# EAGLE design arduino cw nano keyer (EAGLE 7.6.0)
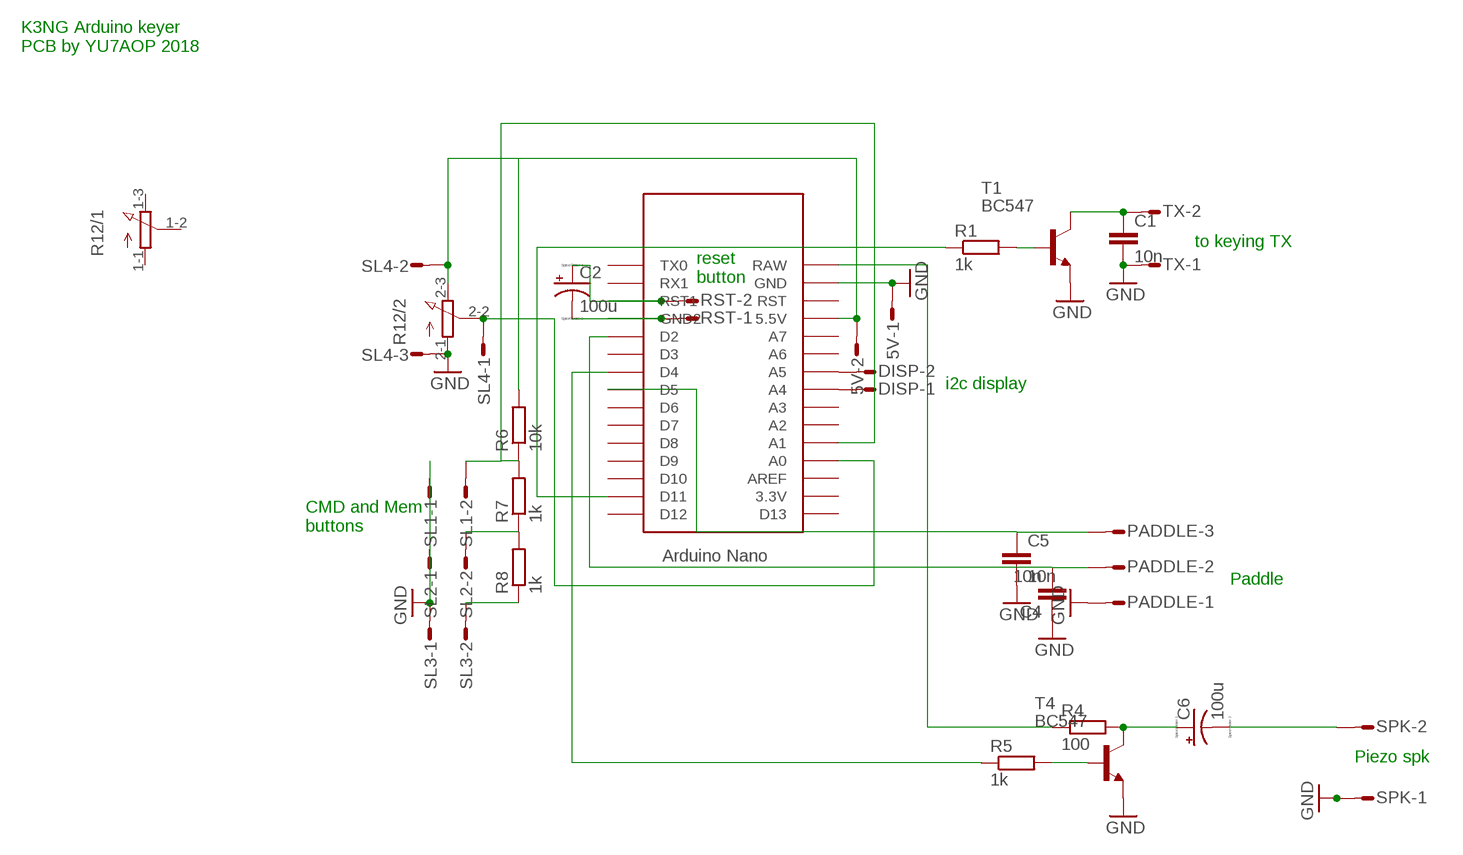
[diagram p0: schematic, sheet 1]

## Parts
5V  M02S  [02P]
C1  10n  C-EU050-025X075  [C050-025X075]
C2  100u  CPOL-USE2.5-5  [E2,5-5]
C4  10n  C-EU050-025X075  [C050-025X075]
C5  10n  C-EU050-025X075  [C050-025X075]
C6  100u  CPOL-USE2.5-5  [E2,5-5]
DISP  M02S  [02P]
PADDLE  M03S  [03P]
R1  1k  R-EU_0207/10  [0207/10]
R4  100  R-EU_0207/10  [0207/10]
R5  1k  R-EU_0207/10  [0207/10]
R6  10k  R-EU_0207/10  [0207/10]
R7  1k  R-EU_0207/10  [0207/10]
R8  1k  R-EU_0207/10  [0207/10]
R12  3RP/1610G  [3RP/1610G]
RST  M02S  [02P]
SL1  M02S  [02P]
SL2  M02S  [02P]
SL3  M02S  [02P]
SL4  M03S  [03P]
SPK  M02S  [02P]
T1  BC547  [TO92]
T4  BC547  [TO92]
TX  M02S  [02P]
U$1  NANO  [NANO]

## Nets
GND: 5V.1 C1.2 C4.1 C5.2 PADDLE.1 R12.2-1(/2:A) SL1.1 SL2.1 SL3.1 SL4.3 SPK.1 T1.1(E) T4.1(E) TX.1 U$1.GND
N$1: R6.1 R7.2 SL1.2 U$1.A1
N$2: R7.1 R8.2 SL2.2
N$3: R8.1 SL3.2
N$4: C2.- RST.1 U$1.GND1(GND2)
N$5: C2.+ RST.2 U$1.RST1
N$6: R1.2 T1.2(B)
N$7: C1.1 T1.3(C) TX.2
N$8: DISP.2 U$1.A5
N$9: DISP.1 U$1.A4
N$11: R1.1 U$1.D11
N$12: R5.2 T4.2(B)
N$13: C6.+ R4.2 T4.3(C)
N$14: 5V.2 R6.2 R12.2-3(/2:E) SL4.2 U$1.5V(5.5V)
N$16: R5.1 U$1.D4
N$17: R12.2-2(/2:S) SL4.1 U$1.A0
N$18: C5.1 PADDLE.3 U$1.D5
N$19: C4.2 PADDLE.2 U$1.D2
N$20: C6.- SPK.2
N$21: R4.1 U$1.RAW
Unconnected: R12.1-1(/1:A) R12.1-2(/1:S) R12.1-3(/1:E) U$1.3.3V U$1.A2 U$1.A3 U$1.A6 U$1.A7 U$1.AREF U$1.D3 U$1.D6 U$1.D7 U$1.D8 U$1.D9 U$1.D10 U$1.D12 U$1.D13 U$1.ICSP1 U$1.ICSP2 U$1.ICSP3 U$1.ICSP4 U$1.ICSP5 U$1.ICSP6 U$1.RST U$1.RX1 U$1.TX0

## Notes on the sheet
- K3NG Arduino keyer
  PCB by YU7AOP 2018
- to keying TX
- reset
  button
- i2c display
- CMD and Mem
  buttons
- Paddle
- Piezo spk

## Library data of the parts
5V DISP RST SL1-SL3 SPK TX = con-amp-quick:M02S: AMP QUICK CONNECTOR; OC_FARNELL: unknown; OC_NEWARK: unknown
C1 C4 C5 = resistor:C-EU: CAPACITOR, European symbol
C2 C6 = resistor:CPOL-US: POLARIZED CAPACITOR, American symbol
PADDLE SL4 = con-amp-quick:M03S: AMP QUICK CONNECTOR; OC_FARNELL: unknown; OC_NEWARK: unknown
R1 R4-R8 = resistor:R-EU_: RESISTOR, European symbol
R12 = pot:3RP/1610G: 16mm Potentiometer two level Source: http://www.alphapotentiometers.net/html/16mm_pot_2.html
T1 T4 = transistor:BC547: NPN TRANSISTOR
U$1 = Arduino-clone:NANO: Arduino Nano

## Board
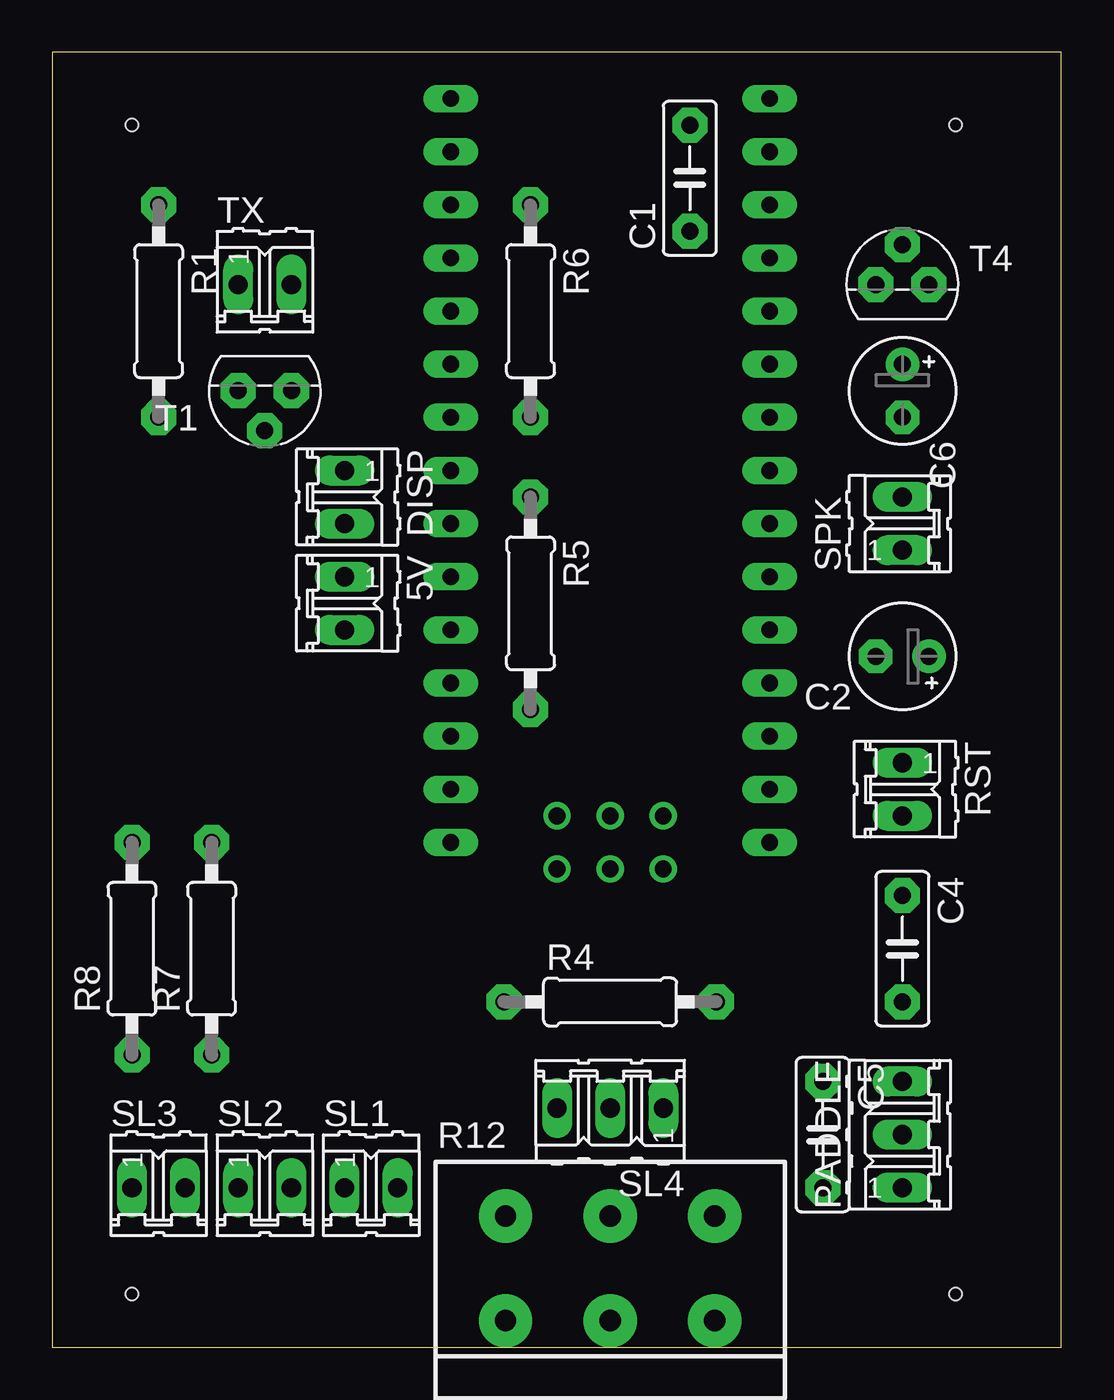
[diagram p1: board, top side]
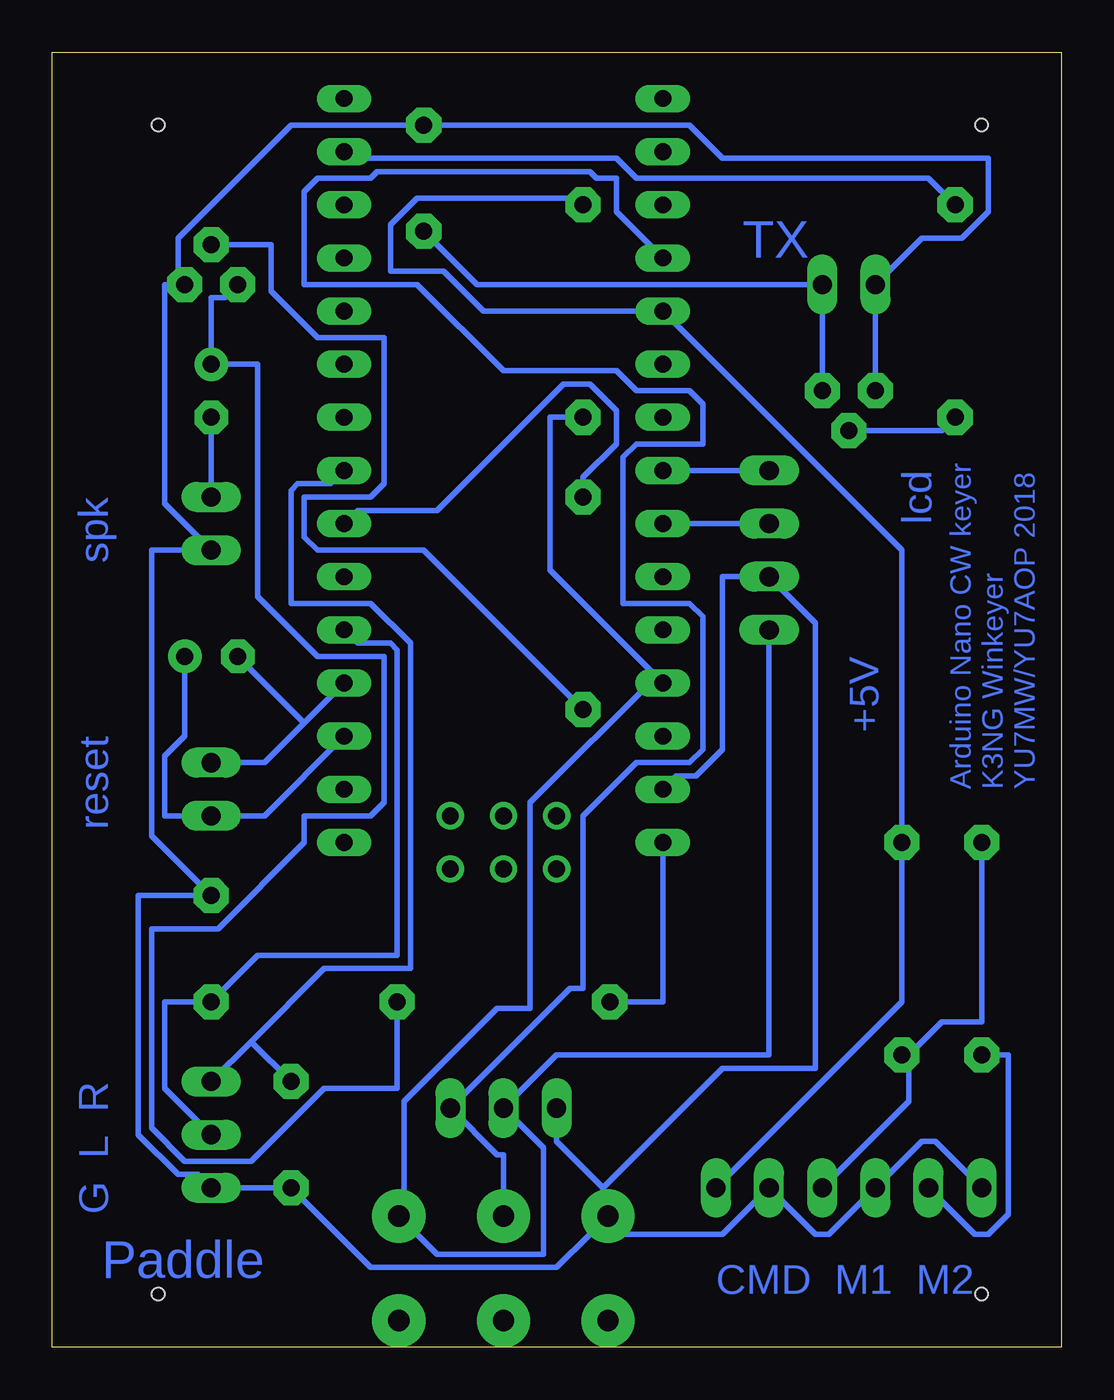
[diagram p2: board, bottom side, seen from below]

Size 48.24 x 61.9 mm. Coordinates in mm from the lower left corner, seen from the top.
Outline: 0,0 48.24,0 48.24,61.9 0,61.9 0,0
Copper layers (1*16): Top 0.035mm / dielectric 1.5mm / Bottom 0.035mm
Design rules "default *": minimum track width 10mil, minimum drill 24mil, track to track 15mil, track to pad 15mil, pad to pad 8mil, via to via 8mil, smd to smd 8mil, copper to edge 40mil, drill to drill 8mil, minimum pad ring 10mil, minimum via ring 8mil, stop-mask expansion 4mil, vias tented up to drill 0mil, thermal gap 10mil
Holes 0.6 mm at 3.81,58.42 43.18,58.42 3.81,2.54 43.18,2.54

### Footprints (pad centres in the part's own frame; a part is rotated, then mirrored left to right if it is on the bottom)
02P = drill 0.914 long: 1 -1.27,0; 2 1.27,0
C050-025X075 = drill 0.813 pad 1.676 octagon: 1 -2.54,0; 2 2.54,0
E2,5-5 = drill 0.813 pad 1.6: + -1.27,0 | drill 0.813 pad 1.6 octagon: - 1.27,0
03P = drill 0.914 long: 1 -2.54,0; 2 0,0; 3 2.54,0
0207/10 = drill 0.813 pad 1.676 octagon: 1 -5.08,0; 2 5.08,0
3RP/1610G = drill 1.016 pad 2.54: 1-1 -5,0; 1-2 0,0; 1-3 5,0; 2-1 -5,5; 2-2 0,5; 2-3 5,5
TO92 = drill 0.813 pad 1.676 octagon: 1 1.27,0; 2 0,1.905; 3 -1.27,0
NANO = drill 0.8 long: 3.3V -10.16,24.13; 5V -10.16,-1.27; A0 -10.16,19.05; A1 -10.16,16.51; A2 -10.16,13.97; A3 -10.16,11.43; A4 -10.16,8.89; A5 -10.16,6.35; A6 -10.16,3.81; A7 -10.16,1.27; AREF -10.16,21.59; D2 5.08,1.27; D3 5.08,3.81; D4 5.08,6.35; D5 5.08,8.89; D6 5.08,11.43; D7 5.08,13.97; D8 5.08,16.51; D9 5.08,19.05; D10 5.08,21.59; D11 5.08,24.13; D12 5.08,26.67; D13 -10.16,26.67; GND -10.16,-6.35; GND1 5.08,-1.27; RAW -10.16,-8.89; RST -10.16,-3.81; RST1 5.08,-3.81; RX1 5.08,-6.35; TX0 5.08,-8.89 | drill 0.8: ICSP1 -5.08,-10.16; ICSP2 -5.08,-7.62; ICSP3 -2.54,-10.16; ICSP4 -2.54,-7.62; ICSP5 0,-10.16; ICSP6 0,-7.62

### Placement (x,y rotation side)
5V  13.97,35.56 270 top
C1  30.48,55.88 90 top
C2  40.64,33.02 180 top
C4  40.64,19.05 270 top
C5  36.83,10.16 270 top
C6  40.64,45.72 270 top
DISP  13.97,40.64 270 top
PADDLE  40.64,10.16 90 top
R1  5.08,49.53 270 top
R4  26.67,16.51 0 top
R5  22.86,35.56 270 top
R6  22.86,49.53 270 top
R7  7.62,19.05 90 top
R8  3.81,19.05 90 top
R12  26.67,1.27 0 top
RST  40.64,26.67 270 top
SL1  15.24,7.62 0 top
SL2  10.16,7.62 0 top
SL3  5.08,7.62 0 top
SL4  26.67,11.43 180 top
SPK  40.64,39.37 90 top
T1  10.16,45.72 180 top
T4  40.64,50.8 0 top
TX  10.16,50.8 0 top
U$1  29.21,33.02 0 top

### Tracks (layer width: path | path; a pad name or v marks a point on that pad's centre or on a via)
GND
  Bottom 0.254: U$1.GND 18.41,27.3 17.46,27.3 16.19,28.57 16.19,36.83 5V.1 11.75,34.61 11.75,13.34 16.19,13.34 21.91,7.62 | SL3.1 6.03,9.84 6.67,9.84 SL2.1 11.11,5.4 11.75,5.4 SL1.1 16.19,5.4 22.54,5.4 | SL4.3 24.13,9.84 21.91,7.62 | 21.91,7.62 21.91,6.35 R12.2-1 | R12.2-1 22.54,5.4 | 22.54,5.4 24.13,3.81 33.02,3.81 C5.2 PADDLE.1 41.27,8.26 42.23,8.26 44.13,10.16 44.13,21.59 C4.1 43.5,24.45 43.5,38.1 SPK.1 42.86,40.32 42.86,50.8 42.23,50.8 | 21.91,6.03 R12.2-1 | T1.1 TX.1 6.67,53.02 4.76,53.02 3.49,54.29 3.49,56.83 16.19,56.83 17.78,58.42 C1.2 36.83,58.42 42.23,53.02 42.23,50.8 | 42.23,50.8 T4.1
N$1
  Bottom 0.254: SL1.2 7.62,16.51 R7.2 7.62,38.1 U$1.A1 27.62,49.53 29.53,51.44 32.07,51.44 32.07,53.66 30.8,54.93 23.18,54.93 R6.1
N$2
  Bottom 0.254: SL2.2 7.3,11.75 7.3,13.97 | R8.2 3.81,15.56 5.71,15.56 7.3,13.97 | 7.3,13.97 R7.1
N$3
  Bottom 0.254: SL3.2 4.13,5.4 3.49,5.4 2.54,6.35 2.54,13.97 R8.1
N$4
  Bottom 0.254: 36.2,29.84 38.1,27.94 RST.1 | 36.2,29.84 U$1.GND1 | 36.2,29.84 C2.-
N$5
  Bottom 0.254: U$1.RST1 38.1,25.4 RST.2 42.86,25.4 42.86,28.26 41.91,29.21 C2.+
N$6
  Bottom 0.254: R1.2 5.71,43.81 T1.2
N$7
  Bottom 0.254: T1.3 TX.2 27.94,50.8 C1.1
N$8
  Bottom 0.254: DISP.2 U$1.A5
N$9
  Bottom 0.254: DISP.1 U$1.A4
N$11
  Bottom 0.254: U$1.D11 33.97,56.83 21.27,56.83 20.32,55.88 6.35,55.88 R1.1
N$12
  Bottom 0.254: R5.2 30.48,38.1 35.56,38.1 36.2,38.73 36.2,40.64 33.02,40.64 32.38,41.27 32.38,48.26 35.56,48.26 37.78,50.48 37.78,52.7 T4.2
N$13
  Bottom 0.254: T4.3 40.01,50.16 40.64,50.16 C6.+ 38.42,46.99 38.42,35.88 35.56,33.02 32.38,33.02 32.38,26.04 33.02,25.4 36.2,25.4 36.2,24.13 40.32,20 43.5,20 43.5,10.48 41.91,8.89 38.73,8.89 35.24,12.38 31.75,12.38 R4.2
N$14
  Bottom 0.254: 19.37,32.07 24.45,37.15 24.45,44.45 R6.2 | 5V.2 13.97,13.97 24.13,13.97 SL4.2 24.77,9.53 24.77,4.45 29.84,4.45 R12.2-3 31.43,6.35 31.43,11.75 26.99,16.19 25.4,16.19 25.4,26.04 19.37,32.07 | 19.37,32.07 U$1.5V
N$16
  Bottom 0.254: U$1.D4 33.66,40.01 29.84,40.01 23.81,46.04 22.54,46.04 21.27,44.77 21.27,43.18 22.86,41.59 R5.1
N$17
  Bottom 0.254: U$1.A0 21.27,54.29 21.27,55.88 22.23,55.88 22.54,56.2 32.7,56.2 33.02,55.88 35.56,55.88 36.2,55.24 36.2,50.8 30.8,50.8 26.67,46.67 21.27,46.67 20.32,45.72 17.78,45.72 17.14,45.09 17.14,43.18 20.32,43.18 20.95,42.55 20.95,35.56 17.78,35.56 17.14,34.92 17.14,28.57 17.78,27.94 20.32,27.94 22.86,25.4 22.86,17.14 23.5,17.14 SL4.1 26.99,9.21 26.67,9.21 R12.2-2
N$18
  Bottom 0.254: U$1.D5 34.92,41.27 36.51,41.27 36.83,40.96 36.83,35.56 33.02,35.56 31.11,33.66 31.11,18.1 35.24,18.1 38.73,14.61 | PADDLE.3 38.73,14.61 | 38.73,14.61 C5.1
N$19
  Bottom 0.254: U$1.D2 33.66,33.66 32.07,33.66 31.75,33.34 31.75,18.73 38.42,18.73 C4.2 42.86,16.51 42.86,12.38 PADDLE.2
N$20
  Bottom 0.254: C6.- SPK.2
N$21
  Bottom 0.254: U$1.RAW 19.05,16.51 R4.1

### Text on the board
Bottom: TX | lcd | spk | +5V | reset | Arduino Nano CW keyer / K3NG Winkeyer / YU7MW/YU7AOP 2018 | G L R | Paddle | CMD M1 M2